# Altium project PCB_Project_1.PrjPcb
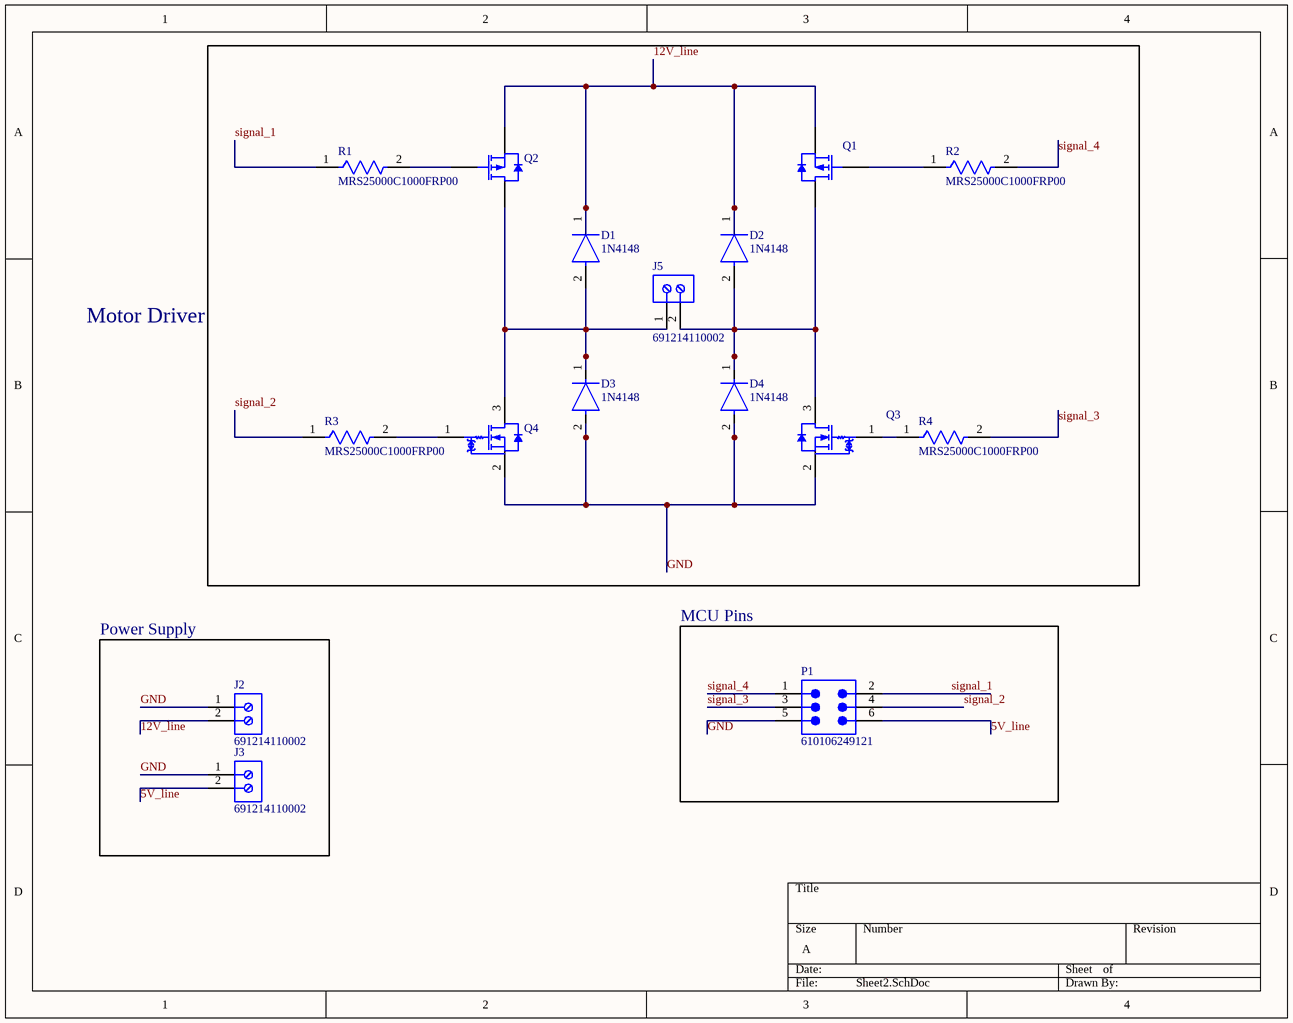
[diagram p0: Sheet2.SchDoc]
1 sheet, 16 parts. Net scope: global (net labels, ports and power ports of the same name join across sheets).
Board file: PCB2.PcbDoc

## Sheet Sheet2.SchDoc
size A; SheetNumber: 1; SheetTotal: 1

### Parts
D1  1N4148  [FP-017AG-MFG]
D2  1N4148  [FP-017AG-MFG]
D3  1N4148  [FP-017AG-MFG]
D4  1N4148  [FP-017AG-MFG]
J2  691214110002  [691214110002]
J3  691214110002  [691214110002]
J5  691214110002  [691214110002]
P1  610106249121  [610106249121]
Q1  SI2323DS-T1-E3  [VISH-SI2323DS-T1-E3-3_V]  (value not drawn)
Q2  SI2323DS-T1-E3  [VISH-SI2323DS-T1-E3-3_V]  (value not drawn)
Q3  2N7002WT1G  [ONSC-SC-70-3-419-04_V]  (value not drawn)
Q4  2N7002WT1G  [ONSC-SC-70-3-419-04_V]  (value not drawn)
R1  MRS25000C1000FRP00  [FP-MRS25-MFG]
R2  MRS25000C1000FRP00  [FP-MRS25-MFG]
R3  MRS25000C1000FRP00  [FP-MRS25-MFG]
R4  MRS25000C1000FRP00  [FP-MRS25-MFG]

### Blocks framed on the sheet
Power Supply: J2 J3
MCU Pins: P1

### Nets
5V_line: J3.2 P1.6
12V_line: D1.1(C) D2.1(C) J2.2 Q1.2(S) Q2.2(S)
GND: D3.2(A) D4.2(A) J2.1 J3.1 P1.5 Q3.2(S) Q4.2(S)
signal_1: P1.2 R1.1
signal_2: P1.4 R3.1
signal_3: P1.3 R4.2
signal_4: P1.1 R2.2
NetD1_2: D1.2(A) D3.1(C) J5.1 Q2.3(D) Q4.3(D)
NetD2_2: D2.2(A) D4.1(C) J5.2 Q1.3(D) Q3.3(D)
NetQ1_1: Q1.1(G) R2.1
NetQ2_1: Q2.1(G) R1.2
NetQ3_1: Q3.1(G) R4.1
NetQ4_1: Q4.1(G) R3.2

### Notes on the sheet
- Motor Driver

### Library data of the parts
D1-D4 = CMP-07163-000046-1: DIODE GEN PURP 100V 200MA DO35; Forward Voltage: 1V; Max Power Dissipation: 500mW; Max Reverse Current: 5uA; Forward Current: 300mA; Current: 4A; Reverse Recovery Time: 4ns; Element Configuration: Single; Outside Diameter: 1.85mm; Capacitance: 4pF; Polarity: Standard; Max Forward Surge Current (Ifsm): 1A; Reverse Voltage: 100V; Output Current: 200mA; Average Rectified Current: 200mA; Diameter: 1.91mm; Max Repetitive Reverse Voltage (Vrrm): 100V; Current Rating: 200mA; Case/Package: DO-35; Lead Free: Lead Free; Number of Pins: 2; Recovery Time: 4ns; Packaging: Bulk; Contact Plating: Tin; Voltage: 100V; Mount: Through Hole; Max Surge Current: 4A; Package Quantity: 2000; Width: 1.91mm; Max Reverse Voltage (DC): 100V; Length: 4.56mm; Radiation Hardening: No; Power Dissipation: 500mW; Voltage Rating (DC): 100V; Peak Non-Repetitive Surge Current: 4A; REACH SVHC: No SVHC; Height: 4.56mm; Max Operating Temperature: 175°C; Series: -; Weight: 0.01lb; Min Operating Temperature: -65°C
J2 J3 J5 = CMP-1502-02464-2: NexarPartId: 18818288; Plating: Brass, Steel; Current: 10A; Pitch: 3.5052mm; Number of Levels: 1; Number of Contacts: 2; Wire Gauge (Min): 16AWG; Voltage: 300V; Wire Gauge (Max): 24AWG; Stripping Length: -6mm; Number of Pins: 2; Number of Rows: 1; REACH SVHC: Unknown; RoHS: Compliant; Housing Material: Nylon; Termination: Screw; Mount: Through Hole; Contact Plating: Brass, Tin; Number of Positions Per Level: 2; Color: Blue, Green; Width: 7.9mm; Voltage Rating: 300V; Length: 7.4mm; Current Rating: 10A; Wire/Cable Gauge: 24AWG; Packaging: Box; Max Operating Temperature: 105°C; Lead Pitch: 3.5mm; Height: 8.7mm; Contact Material: Brass; Min Operating Temperature: -40°C
P1 = CMP-1502-01146-3: NexarPartId: 52645089; Operating Supply Voltage: 250V; Connector Type: Male Pin; Number of Positions: 6; Gender: Male; Current Rating: 3A; Row Spacing: 2.54mm; Contact Resistance: 20mΩ; Number of Pins: 6; Contact Mating Length: 5.9944mm; Termination: Solder; RoHS: Compliant; Mount: Surface Mount; Number of Rows: 2; Number of Contacts: 6; REACH SVHC: Unknown; Color: Black; Contact Plating: Gold; Lead Pitch: 2.54mm; Packaging: Tape and Reel; Pitch: 2.54mm
Q1 Q2 = CMP-2000-07054-1: P-Channel MOSFET, 20 V, -55 to 150 degC, 3-Pin TO-236, RoHS, Tape and Reel; Manufacturer: Vishay; Vgs - Gate-Source Voltage: 8V; Fall Time: 43ns; Brand: VishaySemiconductors; Vds - Drain-Source Breakdown Voltage: -20V; Unit Weight: 0.050717oz; Number of Channels: 1Channel; Pd - Power Dissipation: 750mW; Rds On - Drain-Source Resistance: 39mOhms; Transistor Type: 1P-Channel; Channel Mode: Enhancement; Configuration: Single; Typical Turn-On Delay Time: 25ns; Id - Continuous Drain Current: 3.7A; Typical Turn-Off Delay Time: 71ns; Mounting Technology: SurfaceMount; Package / Case: SOT-23-3; Minimum Operating Temperature: -55C; RoHS: True; Package Reference: TO-236-3; Datasheet Version: Rev. D, 02/2009; Maximum Operating Temperature: +150C; Height: 1.02mm; Product: MOSFETSmallSignal; Manufacturer URL: http://www.vishay.com/; Technology: Si; Mounting Style: SMD/SMT; Package Description: 3-Pin Plastic Small Outline, Body 2.92 x1.3 mm, Pitch 0.95 mm; Tradename: TrenchFET; Length: 3.04mm; Width: 1.4mm; Series: SI2; Package URL: https://www.vishay.com/docs/71196/71196.pdf; Transistor Polarity: P-Channel; Packaging: Reel; Product Category: MOSFET; Factory Pack Quantity: 3000; Datasheet URL: https://datasheet.ciiva.com/15137/getdatasheetpartid-75162-15137380.pdf; Rise Time: 43ns
Q3 Q4 = CMP-1058-00618-1: Small Signal MOSFET, 60 V, 340 mA, Single, N-Channel, 3-Pin SC70, Pb-Free, Tape and Reel; Manufacturer: On Semiconductor; Crss Typ (pF): 2.2; Coss Typ (pF): 4.2; VGS(th) Max (V): 2.5; Channel Polarity: N Channel; ID Max (A): 0.34; VGS Max (V): 20; V(BR)DSS Min (V): 60; Ciss Typ (pF): 24.5; Configuration: Single; Packing: Tape and Reel; Package Type: SC-70-3 / SOT-323-3; RoHS: Pb-Free; ComponentLink3Description: Package Specification; PackageReference: SC-70-3-419-04; Mounting Technology: Surface Mount; PackageVersion: Rev. N, 11/2008; ComponentLink2URL: http://www.onsemi.com/pub_link/Collateral/2N7002W-D.PDF; PartNumber: 2N7002WT1G; ComponentLink2Description: Datasheet; ComponentLink3URL: http://www.onsemi.cn/pub_link/Collateral/419-04.PDF; ComponentLink1Description: Manufacturer URL; ComponentLink1URL: http://www.onsemi.com/; DatasheetVersion: Rev. 5; PackageDescription: 3-Pin Small Outline Transistor, Body 2 x 1.25 mm, Pitch 0.65 mm
R1-R4 = CMP-00030-42757237-1: MRS25000C1000FRP00 Resistor, 100 Ohm, ± 1%, 600 mW, Axial Leaded, Metal Film (Thin Film), Professional; Max Power Dissipation: 600mW; Resistance: 100Ω; Voltage Rating: 350V; Temperature Coefficient: 50ppm/°C; Lead Diameter: 600µm; RoHS: Compliant; Radiation Hardening: No; Schedule B: 8533210090, 8533210090; Length: 6.5mm; Packaging: Tape & Reel (TR); Number of Terminations: 2; Mount: Through Hole; Width: 2.5mm; Tolerance: 1%; Military Standard: Not; Voltage Rating (DC): 350V; Contact Plating: Tin; Number of Pins: 2; Max Operating Temperature: 155°C; NexarPartId: 42757237; Diameter: 2.5mm; Composition: Metal Film, Thin Film; REACH SVHC: Unknown; Power Rating: 600mW; Lead Free: Lead Free; Termination: Axial; Case/Package: Axial; Min Operating Temperature: -55°C